# EAGLE schematic untitled (EAGLE 9.6.2)
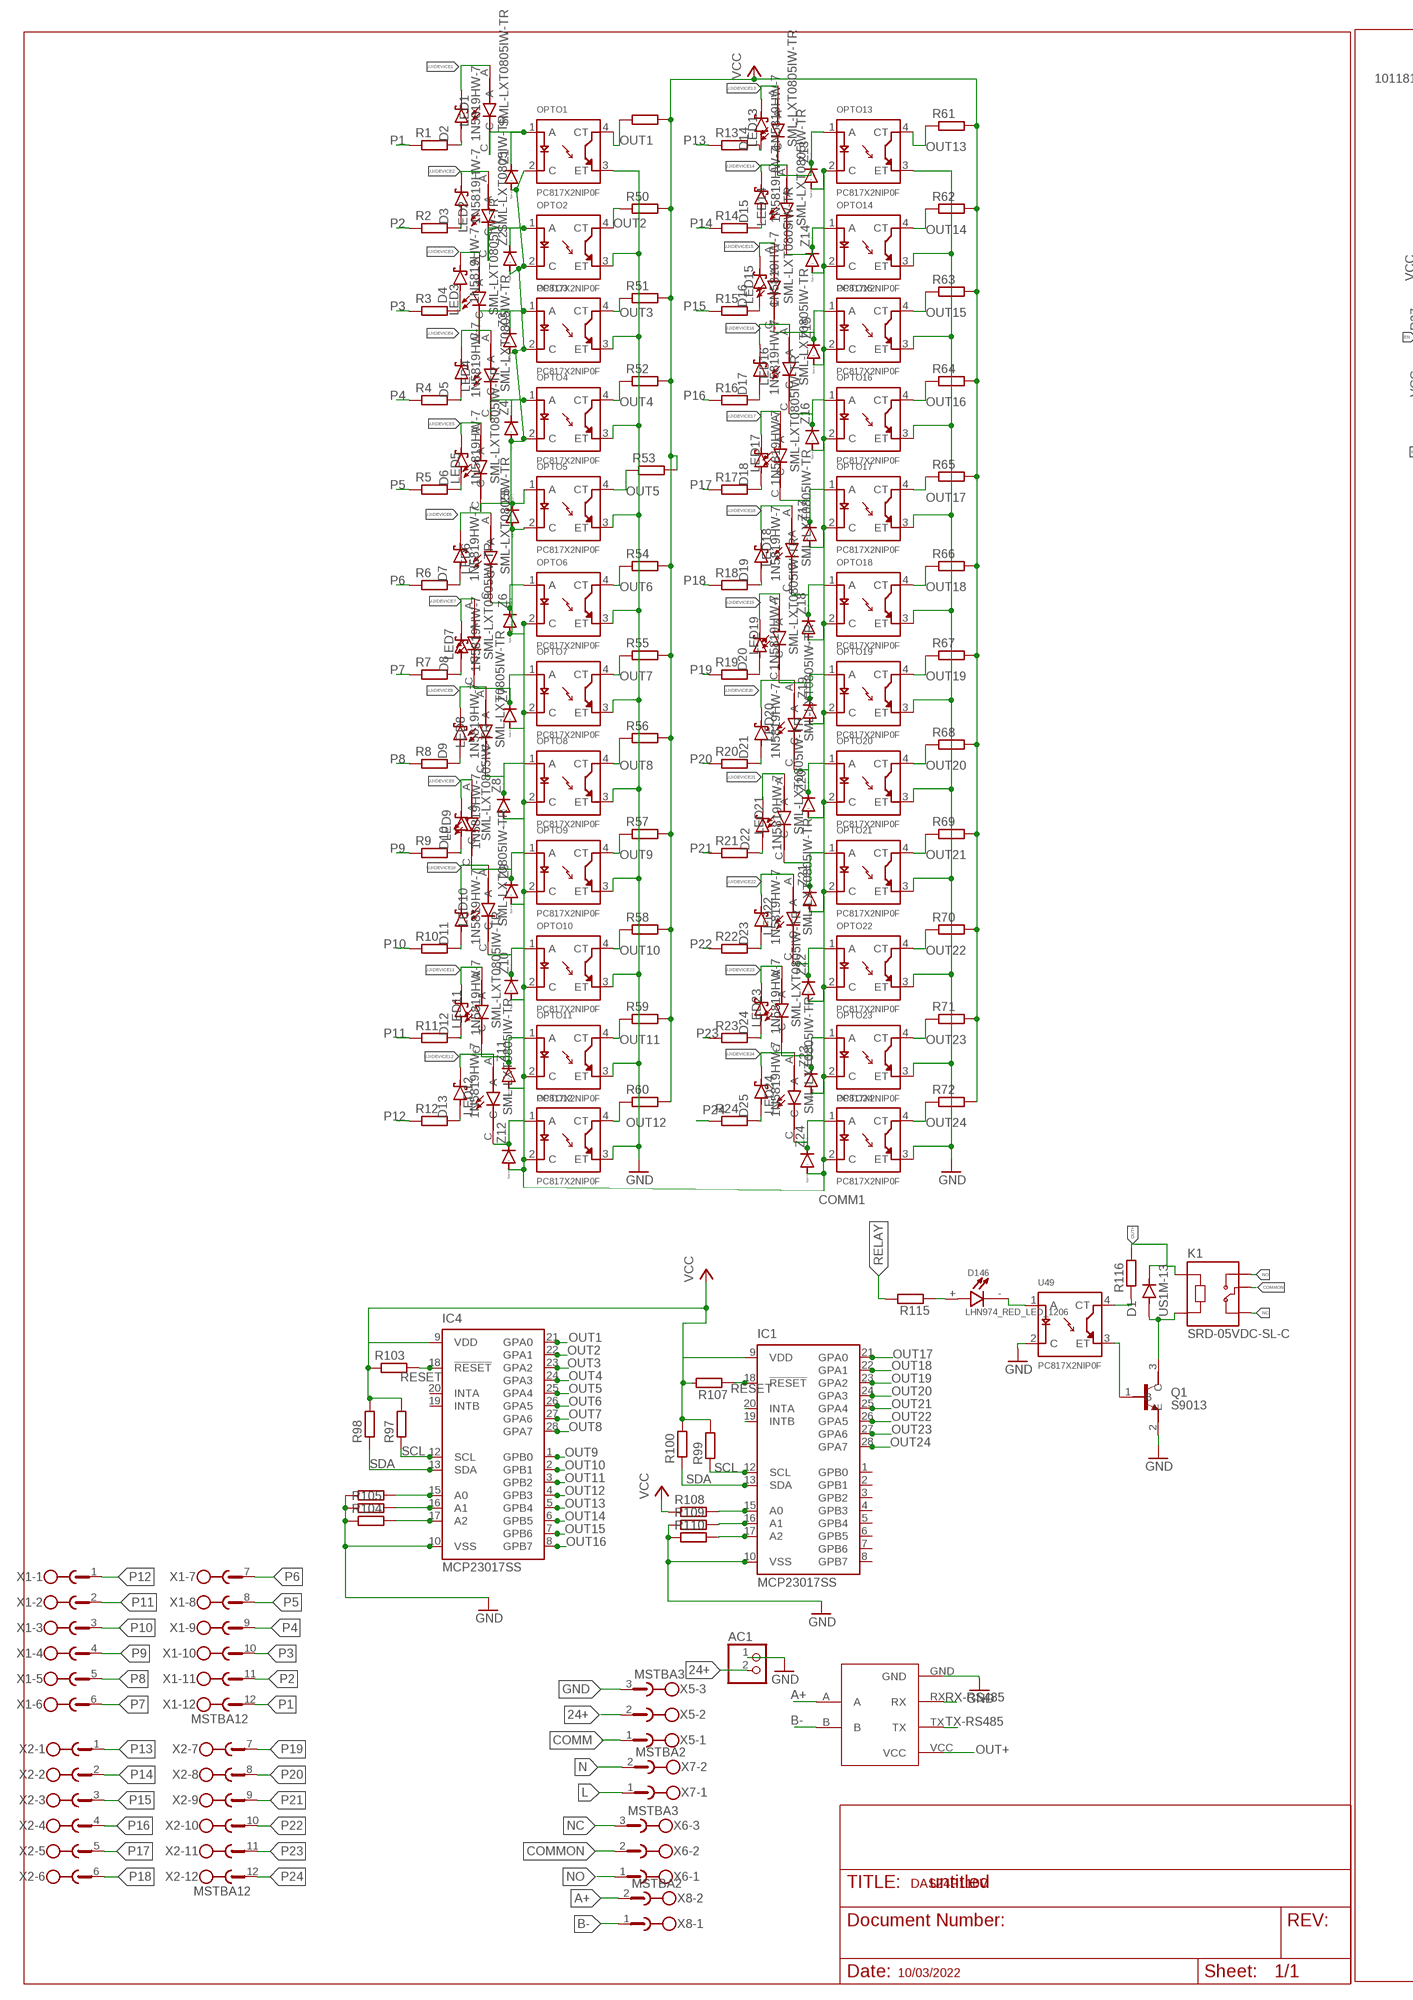
[diagram p0: schematic, sheet 1, part 1 of 2]
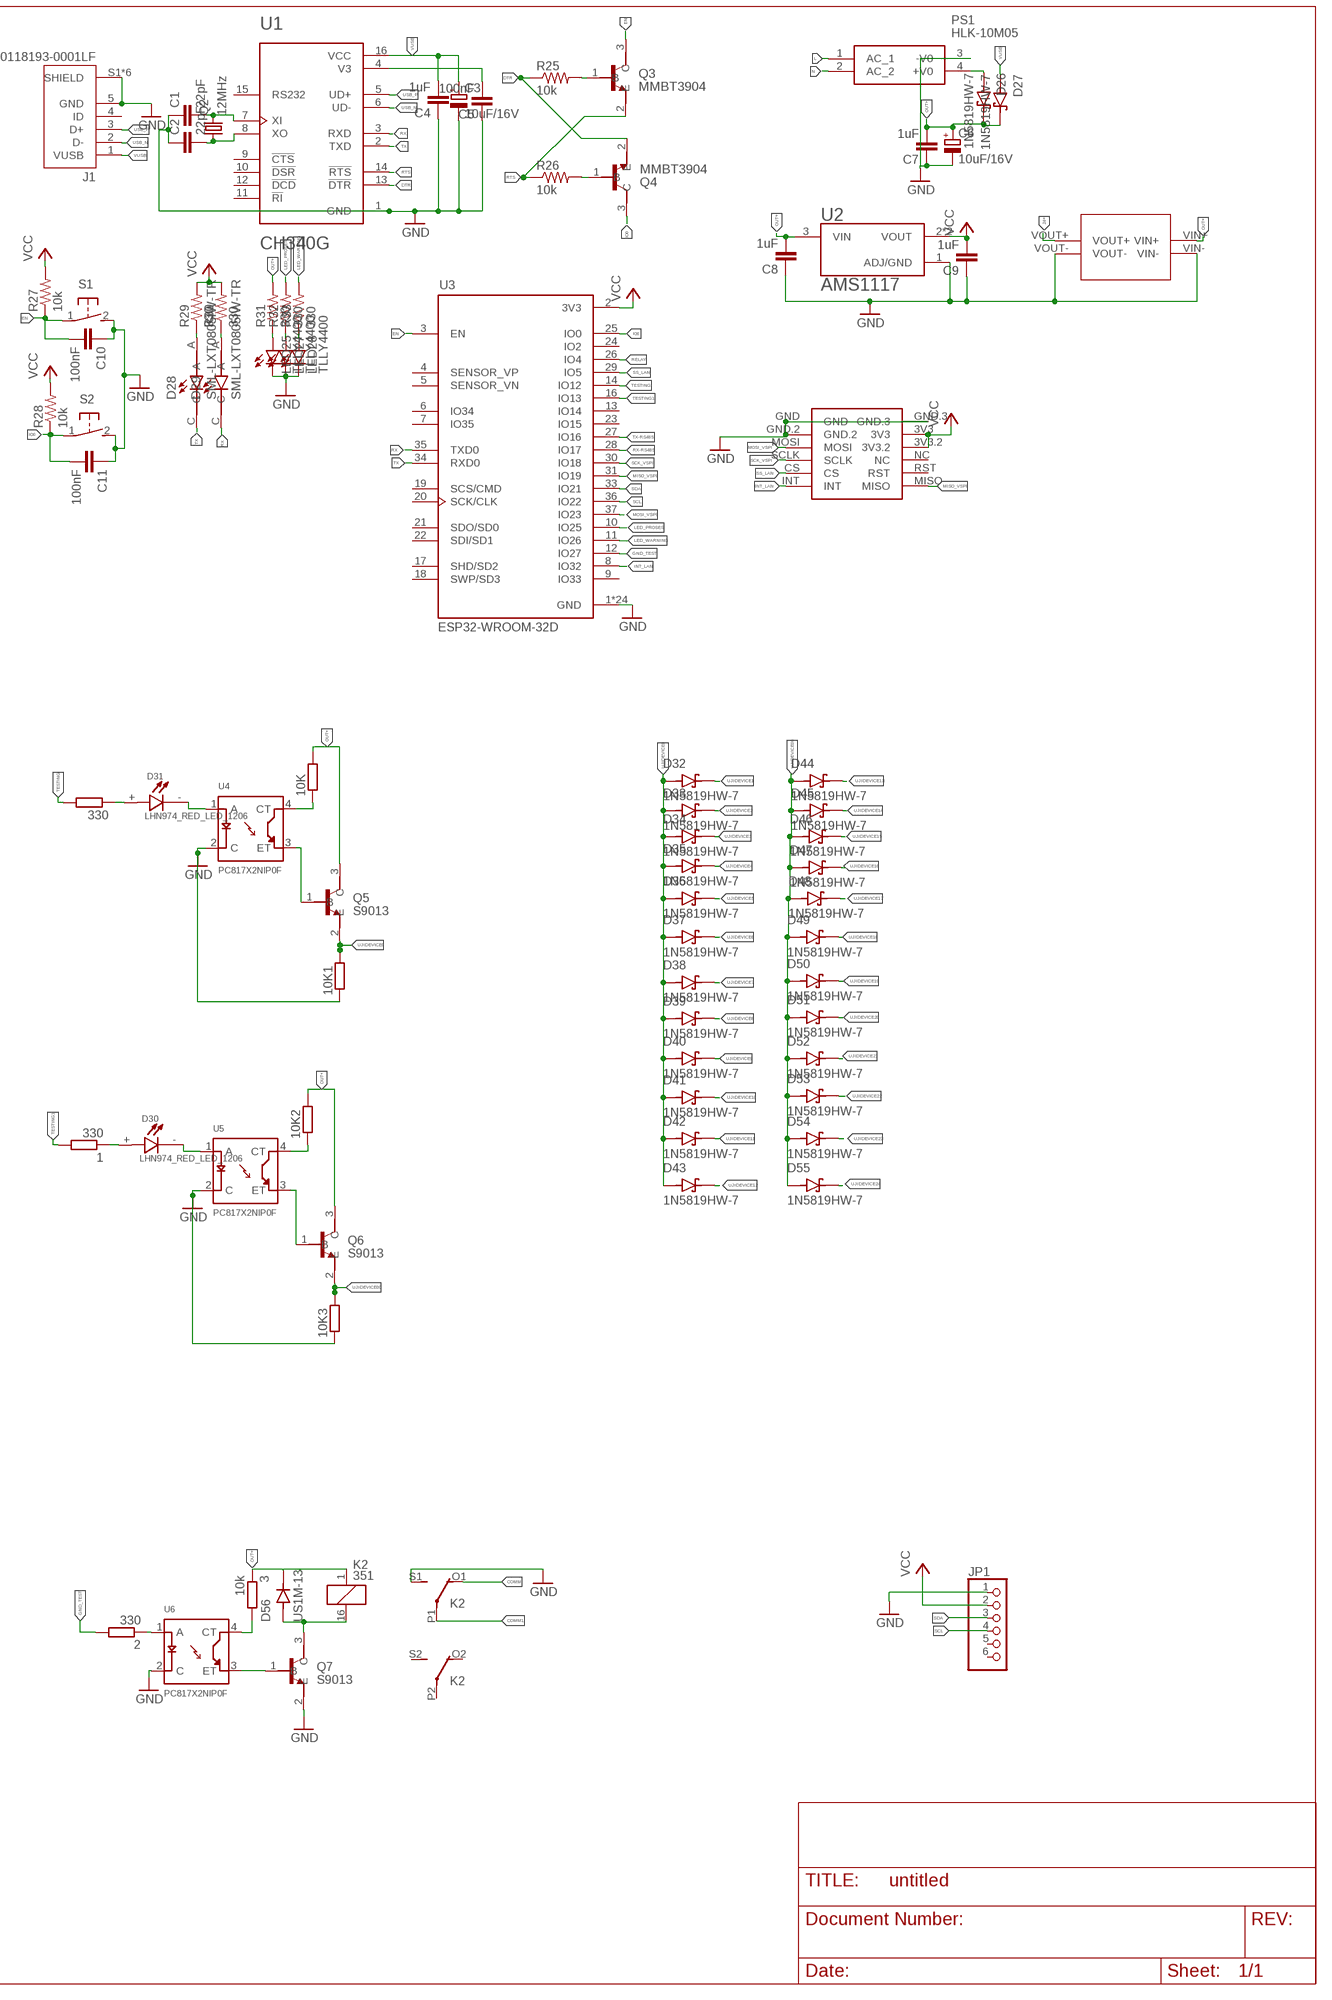
[diagram p1: schematic, sheet 1, part 2 of 2]

## Parts
1  330  R-EU_R0805  [R0805]
2  330  R-EU_R0805  [R0805]
3  10k  R-EU_R0805  [R0805]
10K  R-EU_R0805  [R0805]
10K1  R-EU_R0805  [R0805]
10K2  R-EU_R0805  [R0805]
10K3  R-EU_R0805  [R0805]
330  R-EU_R0805  [R0805]
AC1  PINHD-1X2  [1X02]
C1  22pF  C-EUC0805K  [C0805K]
C2  22pF  C-EUC0805K  [C0805K]
C3  10uF/16V  CPOL-EU153CLV-0505  [153CLV-0505]
C4  1uF  C-EUC0805K  [C0805K]
C5  100nF  C-EUC0805K  [C0805K]
C6  10uF/16V  CPOL-EU153CLV-0505  [153CLV-0505]
C7  1uF  C-EUC0805K  [C0805K]
C8  1uF  C-EUC0805K  [C0805K]
C9  1uF  C-EUC0805K  [C0805K]
C10  100nF  C-EUC0805K  [C0805K]
C11  100nF  C-EUC0805K  [C0805K]
D1  US1M-13  [DIOM5226X240N]
D2  1N5819HW-7  [SOD3715X145N]
D3  1N5819HW-7  [SOD3715X145N]
D4  1N5819HW-7  [SOD3715X145N]
D5  1N5819HW-7  [SOD3715X145N]
D6  1N5819HW-7  [SOD3715X145N]
D7  1N5819HW-7  [SOD3715X145N]
D8  1N5819HW-7  [SOD3715X145N]
D9  1N5819HW-7  [SOD3715X145N]
D10  1N5819HW-7  [SOD3715X145N]
D11  1N5819HW-7  [SOD3715X145N]
D12  1N5819HW-7  [SOD3715X145N]
D13  1N5819HW-7  [SOD3715X145N]
D14  1N5819HW-7  [SOD3715X145N]
D15  1N5819HW-7  [SOD3715X145N]
D16  1N5819HW-7  [SOD3715X145N]
D17  1N5819HW-7  [SOD3715X145N]
D18  1N5819HW-7  [SOD3715X145N]
D19  1N5819HW-7  [SOD3715X145N]
D20  1N5819HW-7  [SOD3715X145N]
D21  1N5819HW-7  [SOD3715X145N]
D22  1N5819HW-7  [SOD3715X145N]
D23  1N5819HW-7  [SOD3715X145N]
D24  1N5819HW-7  [SOD3715X145N]
D25  1N5819HW-7  [SOD3715X145N]
D26  1N5819HW-7  [SOD3715X145N]
D27  1N5819HW-7  [SOD3715X145N]
D28  SML-LXT0805IW-TR  [LEDC2012X120N]
D29  SML-LXT0805IW-TR  [LEDC2012X120N]
D30  LHN974_RED_LED_1206  [LEDC3216X120N]
D31  LHN974_RED_LED_1206  [LEDC3216X120N]
D32  1N5819HW-7  [SOD3715X145N]
D33  1N5819HW-7  [SOD3715X145N]
D34  1N5819HW-7  [SOD3715X145N]
D35  1N5819HW-7  [SOD3715X145N]
D36  1N5819HW-7  [SOD3715X145N]
D37  1N5819HW-7  [SOD3715X145N]
D38  1N5819HW-7  [SOD3715X145N]
D39  1N5819HW-7  [SOD3715X145N]
D40  1N5819HW-7  [SOD3715X145N]
D41  1N5819HW-7  [SOD3715X145N]
D42  1N5819HW-7  [SOD3715X145N]
D43  1N5819HW-7  [SOD3715X145N]
D44  1N5819HW-7  [SOD3715X145N]
D45  1N5819HW-7  [SOD3715X145N]
D46  1N5819HW-7  [SOD3715X145N]
D47  1N5819HW-7  [SOD3715X145N]
D48  1N5819HW-7  [SOD3715X145N]
D49  1N5819HW-7  [SOD3715X145N]
D50  1N5819HW-7  [SOD3715X145N]
D51  1N5819HW-7  [SOD3715X145N]
D52  1N5819HW-7  [SOD3715X145N]
D53  1N5819HW-7  [SOD3715X145N]
D54  1N5819HW-7  [SOD3715X145N]
D55  1N5819HW-7  [SOD3715X145N]
D56  US1M-13  [DIOM5226X240N]
D146  LHN974_RED_LED_1206  [LEDC3216X120N]
IC1  MCP23017SS  [SSOP28DB]
IC4  MCP23017SS  [SSOP28DB]
J1  10118193-0001LF  [FCI_10118193-0001LF]
JP1  PINHD-1X6CLEAN  [1X06-CLEAN]
K1  SRD-05VDC-SL-C  [RELAY_SRD-05VDC-SL-C]
K2  351  [351]
LED1  SML-LXT0805IW-TR  [LEDC2012X120N]
LED2  SML-LXT0805IW-TR  [LEDC2012X120N]
LED3  SML-LXT0805IW-TR  [LEDC2012X120N]
LED4  SML-LXT0805IW-TR  [LEDC2012X120N]
LED5  SML-LXT0805IW-TR  [LEDC2012X120N]
LED6  SML-LXT0805IW-TR  [LEDC2012X120N]
LED7  SML-LXT0805IW-TR  [LEDC2012X120N]
LED8  SML-LXT0805IW-TR  [LEDC2012X120N]
LED9  SML-LXT0805IW-TR  [LEDC2012X120N]
LED10  SML-LXT0805IW-TR  [LEDC2012X120N]
LED11  SML-LXT0805IW-TR  [LEDC2012X120N]
LED12  SML-LXT0805IW-TR  [LEDC2012X120N]
LED13  SML-LXT0805IW-TR  [LEDC2012X120N]
LED14  SML-LXT0805IW-TR  [LEDC2012X120N]
LED15  SML-LXT0805IW-TR  [LEDC2012X120N]
LED16  SML-LXT0805IW-TR  [LEDC2012X120N]
LED17  SML-LXT0805IW-TR  [LEDC2012X120N]
LED18  SML-LXT0805IW-TR  [LEDC2012X120N]
LED19  SML-LXT0805IW-TR  [LEDC2012X120N]
LED20  SML-LXT0805IW-TR  [LEDC2012X120N]
LED21  SML-LXT0805IW-TR  [LEDC2012X120N]
LED22  SML-LXT0805IW-TR  [LEDC2012X120N]
LED23  SML-LXT0805IW-TR  [LEDC2012X120N]
LED24  SML-LXT0805IW-TR  [LEDC2012X120N]
LED25  TLLY4400  [LED3MM]
LED27  TLLY4400  [LED3MM]
LED28  TLLY4400  [LED3MM]
MT1  MT3608  [MT3608]
OPTO1  PC817X2NIP0F  [SOT254P975X400-4N]
OPTO2  PC817X2NIP0F  [SOT254P975X400-4N]
OPTO3  PC817X2NIP0F  [SOT254P975X400-4N]
OPTO4  PC817X2NIP0F  [SOT254P975X400-4N]
OPTO5  PC817X2NIP0F  [SOT254P975X400-4N]
OPTO6  PC817X2NIP0F  [SOT254P975X400-4N]
OPTO7  PC817X2NIP0F  [SOT254P975X400-4N]
OPTO8  PC817X2NIP0F  [SOT254P975X400-4N]
OPTO9  PC817X2NIP0F  [SOT254P975X400-4N]
OPTO10  PC817X2NIP0F  [SOT254P975X400-4N]
OPTO11  PC817X2NIP0F  [SOT254P975X400-4N]
OPTO12  PC817X2NIP0F  [SOT254P975X400-4N]
OPTO13  PC817X2NIP0F  [SOT254P975X400-4N]
OPTO14  PC817X2NIP0F  [SOT254P975X400-4N]
OPTO15  PC817X2NIP0F  [SOT254P975X400-4N]
OPTO16  PC817X2NIP0F  [SOT254P975X400-4N]
OPTO17  PC817X2NIP0F  [SOT254P975X400-4N]
OPTO18  PC817X2NIP0F  [SOT254P975X400-4N]
OPTO19  PC817X2NIP0F  [SOT254P975X400-4N]
OPTO20  PC817X2NIP0F  [SOT254P975X400-4N]
OPTO21  PC817X2NIP0F  [SOT254P975X400-4N]
OPTO22  PC817X2NIP0F  [SOT254P975X400-4N]
OPTO23  PC817X2NIP0F  [SOT254P975X400-4N]
OPTO24  PC817X2NIP0F  [SOT254P975X400-4N]
PS1  HLK-10M05  [HLK10M05]
Q1  S9013  [SOT95P240X120-3N]
Q2  12MHz  CRYSTALSM49  [SM49]
Q3  MMBT3904  [SOT95P240X120-3N]
Q4  MMBT3904  [SOT95P240X120-3N]
Q5  S9013  [SOT95P240X120-3N]
Q6  S9013  [SOT95P240X120-3N]
Q7  S9013  [SOT95P240X120-3N]
R1  R-EU_0414/15  [0414/15]
R2  R-EU_0414/15  [0414/15]
R3  R-EU_0414/15  [0414/15]
R4  R-EU_0414/15  [0414/15]
R5  R-EU_0414/15  [0414/15]
R6  R-EU_0414/15  [0414/15]
R7  R-EU_0414/15  [0414/15]
R8  R-EU_0414/15  [0414/15]
R9  R-EU_0414/15  [0414/15]
R10  R-EU_0414/15  [0414/15]
R11  R-EU_0414/15  [0414/15]
R12  R-EU_0414/15  [0414/15]
R13  R-EU_0414/15  [0414/15]
R14  R-EU_0414/15  [0414/15]
R15  R-EU_0414/15  [0414/15]
R16  R-EU_0414/15  [0414/15]
R17  R-EU_0414/15  [0414/15]
R18  R-EU_0414/15  [0414/15]
R19  R-EU_0414/15  [0414/15]
R20  R-EU_0414/15  [0414/15]
R21  R-EU_0414/15  [0414/15]
R22  R-EU_0414/15  [0414/15]
R23  R-EU_0414/15  [0414/15]
R24  R-EU_0414/15  [0414/15]
R25  10k  R-US_M0805  [M0805]
R26  10k  R-US_M0805  [M0805]
R27  10k  R-US_M0805  [M0805]
R28  10k  R-US_M0805  [M0805]
R29  330  R-US_M0805  [M0805]
R30  330  R-US_M0805  [M0805]
R31  330  R-US_M0805  [M0805]
R32  330  R-US_M0805  [M0805]
R33  330  R-US_M0805  [M0805]
R49  R-EU_R0805  [R0805]
R50  R-EU_R0805  [R0805]
R51  R-EU_R0805  [R0805]
R52  R-EU_R0805  [R0805]
R53  R-EU_R0805  [R0805]
R54  R-EU_R0805  [R0805]
R55  R-EU_R0805  [R0805]
R56  R-EU_R0805  [R0805]
R57  R-EU_R0805  [R0805]
R58  R-EU_R0805  [R0805]
R59  R-EU_R0805  [R0805]
R60  R-EU_R0805  [R0805]
R61  R-EU_R0805  [R0805]
R62  R-EU_R0805  [R0805]
R63  R-EU_R0805  [R0805]
R64  R-EU_R0805  [R0805]
R65  R-EU_R0805  [R0805]
R66  R-EU_R0805  [R0805]
R67  R-EU_R0805  [R0805]
R68  R-EU_R0805  [R0805]
R69  R-EU_R0805  [R0805]
R70  R-EU_R0805  [R0805]
R71  R-EU_R0805  [R0805]
R72  R-EU_R0805  [R0805]
R97  R-EU_R0805  [R0805]
R98  R-EU_R0805  [R0805]
R99  R-EU_R0805  [R0805]
R100  R-EU_R0805  [R0805]
R103  R-EU_R0805  [R0805]
R104  R-EU_R0805  [R0805]
R105  R-EU_R0805  [R0805]
R106  R-EU_R0805  [R0805]
R107  R-EU_R0805  [R0805]
R108  R-EU_R0805  [R0805]
R109  R-EU_R0805  [R0805]
R110  R-EU_R0805  [R0805]
R115  R-EU_R0805  [R0805]
R116  R-EU_R0805  [R0805]
S1  31-XX  [B3F-31XX]
S2  31-XX  [B3F-31XX]
TTL-RS1  TTL-RS485  [TTL-RS485]
U1  CH340G  [SOIC127P600X180-16N]
U2  AMS1117  [SOT229P700X180-4N]
U3  ESP32-WROOM-32D  [MODULE_ESP32-WROOM-32D]
U4  PC817X2NIP0F  [SOT254P975X400-4N]
U5  PC817X2NIP0F  [SOT254P975X400-4N]
U6  PC817X2NIP0F  [SOT254P975X400-4N]
U49  PC817X2NIP0F  [SOT254P975X400-4N]
U$1  MINI_W5500  [MINI_W5500]
X1  MSTBA12  [MSTBA12]
X2  MSTBA12  [MSTBA12]
X5  MSTBA3  [MSTBA3]
X6  MSTBA3  [MSTBA3]
X7  MSTBA2  [MSTBA2]
X8  MSTBA2  [MSTBA2]
Z1  DIODE-SOD123  [SOD123]
Z2  DIODE-SOD123  [SOD123]
Z3  DIODE-SOD123  [SOD123]
Z4  DIODE-SOD123  [SOD123]
Z5  DIODE-SOD123  [SOD123]
Z6  DIODE-SOD123  [SOD123]
Z7  DIODE-SOD123  [SOD123]
Z8  DIODE-SOD123  [SOD123]
Z9  DIODE-SOD123  [SOD123]
Z10  DIODE-SOD123  [SOD123]
Z11  DIODE-SOD123  [SOD123]
Z12  DIODE-SOD123  [SOD123]
Z13  DIODE-SOD123  [SOD123]
Z14  DIODE-SOD123  [SOD123]
Z15  DIODE-SOD123  [SOD123]
Z16  DIODE-SOD123  [SOD123]
Z17  DIODE-SOD123  [SOD123]
Z18  DIODE-SOD123  [SOD123]
Z19  DIODE-SOD123  [SOD123]
Z20  DIODE-SOD123  [SOD123]
Z21  DIODE-SOD123  [SOD123]
Z22  DIODE-SOD123  [SOD123]
Z23  DIODE-SOD123  [SOD123]
Z24  DIODE-SOD123  [SOD123]

## Nets
24+: AC1.2 MT1.VOUT+ X5.2
A+: TTL-RS1.A X8.2
B-: TTL-RS1.B X8.1
COMM: K2.O1(2:O) X5.1
COMM1: K2.P1(2:P) OPTO1.2(C) OPTO2.2(C) OPTO3.2(C) OPTO4.2(C) OPTO5.2(C) OPTO6.2(C) OPTO7.2(C) OPTO8.2(C) OPTO9.2(C) OPTO10.2(C) OPTO11.2(C) OPTO12.2(C) OPTO13.2(C) OPTO14.2(C) OPTO15.2(C) OPTO16.2(C) OPTO17.2(C) OPTO18.2(C) OPTO19.2(C) OPTO20.2(C) OPTO21.2(C) OPTO22.2(C) OPTO23.2(C) OPTO24.2(C) Z1.A Z2.A Z3.A Z4.A Z5.A Z6.A Z7.A Z8.A Z9.A Z10.A Z11.A Z12.A Z13.A Z14.A Z15.A Z16.A Z17.A Z18.A Z19.A Z20.A Z21.A Z22.A Z23.A Z24.A
COMMON: K1.COM X6.2
DTR: Q4.2(E) R25.1 U1.13(!DTR)
EN: C10.2 Q3.3(C) R27.1 S1.1(P) U3.3(EN)
GND: 10K1.1 10K3.1 AC1.1 C1.1 C2.1 C3.- C4.1 C5.1 C6.- C7.1 C8.1 C9.1 C10.1 C11.1 IC1.10(VSS) IC4.10(VSS) J1.5(GND) J1.S1(SHIELD) J1.S2(SHIELD) J1.S3(SHIELD) J1.S4(SHIELD) J1.S5(SHIELD) J1.S6(SHIELD) JP1.1 K2.S1(2:S) LED25.K(C) LED27.K(C) LED28.K(C) MT1.VIN- MT1.VOUT- OPTO1.3(ET) OPTO2.3(ET) OPTO3.3(ET) OPTO4.3(ET) OPTO5.3(ET) OPTO6.3(ET) OPTO7.3(ET) OPTO8.3(ET) OPTO9.3(ET) OPTO10.3(ET) OPTO11.3(ET) OPTO12.3(ET) OPTO13.3(ET) OPTO14.3(ET) OPTO15.3(ET) OPTO16.3(ET) OPTO17.3(ET) OPTO18.3(ET) OPTO19.3(ET) OPTO20.3(ET) OPTO21.3(ET) OPTO22.3(ET) OPTO23.3(ET) OPTO24.3(ET) PS1.3(-V0) Q1.2(E) Q7.2(E) R104.1 R105.1 R106.1 R109.1 R110.1 S1.2(S) S2.2(S) TTL-RS1.GND U1.1(GND) U2.1(ADJ/GND) U3.1(GND) U3.15(GND) U3.38(GND) U3.39_1(GND) U3.39_2(GND) U3.39_3(GND) U3.39_4(GND) U3.39_5(GND) U3.39_6(GND) U3.39_7(GND) U3.39_8(GND) U3.39_9(GND) U3.39_10(GND) U3.39_11(GND) U3.39_12(GND) U3.39_13(GND) U3.39_14(GND) U3.39_15(GND) U3.39_16(GND) U3.39_17(GND) U3.39_18(GND) U3.39_19(GND) U3.39_20(GND) U3.39_21(GND) U4.2(C) U5.2(C) U6.2(C) U49.2(C) U$1.GND U$1.GND.2 U$1.GND.3 X5.3
GND_TEST: 2.2 U3.12(IO27)
INT_LAN: U3.8(IO32) U$1.INT
IO0: C11.2 Q4.3(C) R28.1 S2.1(P) U3.25(IO0)
L: PS1.1(AC_1) X7.1
LED_PROSES: R32.2 U3.10(IO25)
LED_WARNING: R33.2 U3.11(IO26)
MISO_VSPI: U3.31(IO19) U$1.MISO
MOSI_VSPI: U3.37(IO23) U$1.MOSI
N: PS1.2(AC_2) X7.2
N$1: D2.A R1.2
N$2: LED10.C OPTO10.1(A) Z10.C
N$3: D3.A R2.2
N$5: D4.A R3.2
N$6: LED1.C OPTO1.1(A) Z1.C
N$7: D5.A R4.2
N$8: LED27.A R32.1
N$9: D6.A R5.2
N$10: LED28.A R33.1
N$11: D7.A R6.2
N$12: LED2.C OPTO2.1(A) Z2.C
N$13: D8.A R7.2
N$14: 2.1 U6.1(A)
N$15: D9.A R8.2
N$16: LED3.C OPTO3.1(A) Z3.C
N$17: D15.A R14.2
N$18: 3.2 U6.4(CT)
N$19: LED4.C OPTO4.1(A) Z4.C
N$20: D10.A R9.2
N$22: LED5.C OPTO5.1(A) Z5.C
N$23: D56.A K2.16 Q7.3(C)
N$24: D11.A R10.2
N$25: Q7.1(B) U6.3(ET)
N$26: LED6.C OPTO6.1(A) Z6.C
N$27: C1.2 Q2.2 U1.7(XI)
N$28: D12.A R11.2
N$29: C2.2 Q2.1 U1.8(XO)
N$30: Q3.1(B) R25.2
N$32: C5.2 U1.4(V3)
N$33: Q4.1(B) R26.2
N$34: D26.A PS1.4(+V0)
N$35: 330.1 D31.+
N$36: D13.A R12.2
N$37: LED25.A R31.1
N$38: D28.A R29.1
N$39: D29.A R30.1
N$40: D14.A R13.2
N$41: 1.1 D30.+
N$42: D31.- U4.1(A)
N$43: 10K.1 U4.4(CT)
N$44: D16.A R15.2
N$45: Q5.1(B) U4.3(ET)
N$46: D30.- U5.1(A)
N$47: 10K2.1 U5.4(CT)
N$48: D17.A R16.2
N$52: D18.A R17.2
N$56: D19.A R18.2
N$60: D20.A R19.2
N$66: D21.A R20.2
N$70: LED7.C OPTO7.1(A) Z7.C
N$71: D22.A R21.2
N$72: LED8.C OPTO8.1(A) Z8.C
N$73: LED9.C OPTO9.1(A) Z9.C
N$74: LED11.C OPTO11.1(A) Z11.C
N$75: LED12.C OPTO12.1(A) Z12.C
N$76: D23.A R22.2
N$77: LED13.C OPTO13.1(A) Z13.C
N$78: LED14.C OPTO14.1(A) Z14.C
N$79: LED15.C OPTO15.1(A) Z15.C
N$80: D24.A R23.2
N$81: LED16.C OPTO16.1(A) Z16.C
N$82: LED17.C OPTO17.1(A) Z17.C
N$83: LED18.C OPTO18.1(A) Z18.C
N$84: D25.A R24.2
N$85: LED19.C OPTO19.1(A) Z19.C
N$86: LED20.C OPTO20.1(A) Z20.C
N$87: LED21.C OPTO21.1(A) Z21.C
N$88: LED22.C OPTO22.1(A) Z22.C
N$89: LED23.C OPTO23.1(A) Z23.C
N$90: LED24.C OPTO24.1(A) Z24.C
N$91: Q6.1(B) U5.3(ET)
N$97: D146.- U49.1(A)
N$98: D146.+ R115.1
N$99: R116.1 U49.4(CT)
N$101: D1.A K1.A2 Q1.3(C)
N$102: Q1.1(B) U49.3(ET)
N$107: IC1.15(A0) R108.2
N$108: IC1.16(A1) R109.2
N$109: IC4.15(A0) R106.2
N$110: IC4.16(A1) R105.2
N$111: IC4.17(A2) R104.2
N$113: IC1.17(A2) R110.2
N$135: IC1.20(INTA)
N$136: IC1.19(INTB)
NC: K1.NC X6.3
NO: K1.NO X6.1
OUT1: IC4.21(GPA0) OPTO1.4(CT) R49.1
OUT2: IC4.22(GPA1) OPTO2.4(CT) R50.1
OUT3: IC4.23(GPA2) OPTO3.4(CT) R51.1
OUT4: IC4.24(GPA3) OPTO4.4(CT) R52.1
OUT5: IC4.25(GPA4) OPTO5.4(CT) R53.1
OUT6: IC4.26(GPA5) OPTO6.4(CT) R54.1
OUT7: IC4.27(GPA6) OPTO7.4(CT) R55.1
OUT8: IC4.28(GPA7) OPTO8.4(CT) R56.1
OUT9: IC4.1(GPB0) OPTO9.4(CT) R57.1
OUT10: IC4.2(GPB1) OPTO10.4(CT) R58.1
OUT11: IC4.3(GPB2) OPTO11.4(CT) R59.1
OUT12: IC4.4(GPB3) OPTO12.4(CT) R60.1
OUT13: IC4.5(GPB4) OPTO13.4(CT) R61.1
OUT14: IC4.6(GPB5) OPTO14.4(CT) R62.1
OUT15: IC4.7(GPB6) OPTO15.4(CT) R63.1
OUT16: IC4.8(GPB7) OPTO16.4(CT) R64.1
OUT17: IC1.21(GPA0) OPTO17.4(CT) R65.1
OUT18: IC1.22(GPA1) OPTO18.4(CT) R66.1
OUT19: IC1.23(GPA2) OPTO19.4(CT) R67.1
OUT20: IC1.24(GPA3) OPTO20.4(CT) R68.1
OUT21: IC1.25(GPA4) OPTO21.4(CT) R69.1
OUT22: IC1.26(GPA5) OPTO22.4(CT) R70.1
OUT23: IC1.27(GPA6) OPTO23.4(CT) R71.1
OUT24: IC1.28(GPA7) OPTO24.4(CT) R72.1
OUT+: 3.1 10K2.2 10K.2 C6.+ C7.2 C8.2 D1.C(K) D26.C(K) D27.C(K) D56.C(K) K1.A1 K2.1 MT1.VIN+ Q5.3(C) Q6.3(C) R31.2 R116.2 TTL-RS1.VCC U2.3(VIN)
P1: R1.1 X1.12
P2: R2.1 X1.11
P3: R3.1 X1.10
P4: R4.1 X1.9
P5: R5.1 X1.8
P6: R6.1 X1.7
P7: R7.1 X1.6
P8: R8.1 X1.5
P9: R9.1 X1.4
P10: R10.1 X1.3
P11: R11.1 X1.2
P12: R12.1 X1.1
P13: R13.1 X2.1
P14: R14.1 X2.2
P15: R15.1 X2.3
P16: R16.1 X2.4
P17: R17.1 X2.5
P18: R18.1 X2.6
P19: R19.1 X2.7
P20: R20.1 X2.8
P21: R21.1 X2.9
P22: R22.1 X2.10
P23: R23.1 X2.11
P24: R24.1 X2.12
RELAY: R115.2 U3.26(IO4)
RESET: IC1.18(!RESET) IC4.18(!RESET) R103.2 R107.1
RTS: Q3.2(E) R26.1 U1.14(!RTS)
RX: D29.C U1.3(RXD) U3.35(TXD0)
RX-RS485: TTL-RS1.RX U3.28(IO17)
SCK_VSPI: U3.30(IO18) U$1.SCLK
SCL: IC1.12(SCL) IC4.12(SCL) JP1.4 R97.1 R99.1 U3.36(IO22)
SDA: IC1.13(SDA) IC4.13(SDA) JP1.3 R98.1 R100.1 U3.33(IO21)
SS_LAN: U3.29(IO5) U$1.CS
TESTING: 330.2 U3.14(IO12)
TESTING1: 1.2 U3.16(IO13)
TX: D28.C U1.2(TXD) U3.34(RXD0)
TX-RS485: TTL-RS1.TX U3.27(IO16)
UJIDEVICE0: 10K1.2 D32.A D33.A D34.A D35.A D36.A D37.A D38.A D39.A D40.A D41.A D42.A D43.A Q5.2(E)
UJIDEVICE00: 10K3.2 D44.A D45.A D46.A D47.A D48.A D49.A D50.A D51.A D52.A D53.A D54.A D55.A Q6.2(E)
UJIDEVICE1: D2.C(K) D32.C(K) LED1.A
UJIDEVICE2: D3.C(K) D33.C(K) LED2.A
UJIDEVICE3: D4.C(K) D34.C(K) LED3.A
UJIDEVICE4: D5.C(K) D35.C(K) LED4.A
UJIDEVICE5: D6.C(K) D36.C(K) LED5.A
UJIDEVICE6: D7.C(K) D37.C(K) LED6.A
UJIDEVICE7: D8.C(K) D38.C(K) LED7.A
UJIDEVICE8: D9.C(K) D39.C(K) LED8.A
UJIDEVICE9: D10.C(K) D40.C(K) LED9.A
UJIDEVICE10: D11.C(K) D41.C(K) LED10.A
UJIDEVICE11: D12.C(K) D42.C(K) LED11.A
UJIDEVICE12: D13.C(K) D43.C(K) LED12.A
UJIDEVICE13: D14.C(K) D44.C(K) LED13.A
UJIDEVICE14: D15.C(K) D45.C(K) LED14.A
UJIDEVICE15: D16.C(K) D46.C(K) LED15.A
UJIDEVICE16: D17.C(K) D47.C(K) LED16.A
UJIDEVICE17: D18.C(K) D48.C(K) LED17.A
UJIDEVICE18: D19.C(K) D49.C(K) LED18.A
UJIDEVICE19: D20.C(K) D50.C(K) LED19.A
UJIDEVICE20: D21.C(K) D51.C(K) LED20.A
UJIDEVICE21: D22.C(K) D52.C(K) LED21.A
UJIDEVICE22: D23.C(K) D53.C(K) LED22.A
UJIDEVICE23: D24.C(K) D54.C(K) LED23.A
UJIDEVICE24: D25.C(K) D55.C(K) LED24.A
USB_N: J1.2(D-) U1.6(UD-)
USB_P: J1.3(D+) U1.5(UD+)
VCC: C9.2 IC1.9(VDD) IC4.9(VDD) JP1.2 R27.2 R28.2 R29.2 R30.2 R49.2 R50.2 R51.2 R52.2 R53.2 R54.2 R55.2 R56.2 R57.2 R58.2 R59.2 R60.2 R61.2 R62.2 R63.2 R64.2 R65.2 R66.2 R67.2 R68.2 R69.2 R70.2 R71.2 R72.2 R97.2 R98.2 R99.2 R100.2 R103.1 R107.2 R108.1 U2.2(VOUT) U2.4(VOUT) U3.2(3V3) U$1.3V3 U$1.3V3.2
VUSB: C3.+ C4.2 D27.A J1.1(VUSB) U1.16(VCC)
Unconnected: IC1.1(GPB0) IC1.2(GPB1) IC1.3(GPB2) IC1.4(GPB3) IC1.5(GPB4) IC1.6(GPB5) IC1.7(GPB6) IC1.8(GPB7) IC4.19(INTB) IC4.20(INTA) J1.4(ID) JP1.5 JP1.6 K2.O2(3:O) K2.P2(3:P) K2.S2(3:S) U1.9(!CTS) U1.10(!DSR) U1.11(!RI) U1.12(!DCD) U1.15(RS232) U3.4(SENSOR_VP) U3.5(SENSOR_VN) U3.6(IO34) U3.7(IO35) U3.9(IO33) U3.13(IO14) U3.17(SHD/SD2) U3.18(SWP/SD3) U3.19(SCS/CMD) U3.20(SCK/CLK) U3.21(SDO/SD0) U3.22(SDI/SD1) U3.23(IO15) U3.24(IO2) U$1.NC U$1.RST

## Notes on the sheet
- DAS24P110V
- 10/03/2022

## Library data of the parts
1-3 10K 10K1-10K3 330 R1-R24 R49-R72 R97-R100 R103-R110 R115 R116 = rcl:R-EU_: RESISTOR, European symbol; SPICEPREFIX: R
AC1 = pinhead:PINHD-1X2: PIN HEADER
C1 C2 C4 C5 C7-C11 = rcl:C-EU: CAPACITOR, European symbol; SPICEPREFIX: C
C3 C6 = rcl:CPOL-EU: POLARIZED CAPACITOR, European symbol; SPICEPREFIX: C
D1 D56 = US1M-13:US1M-13: Diode, Fast Recovery, 1a, 1kv, Do-214ac-2, Full Reel Check availability <https://pricing.snapeda.com/parts/US1M-13/Diodes%20Incorporated/view-part?ref=eda>; AVAILABILITY: In Stock; DESCRIPTION: Diode Standard 1000 V 1A Surface Mount SMA; MF: Diodes Incorporated; MP: US1M-13; PACKAGE: DO-214AC-214 Diodes Incorporated; PRICE: None; PURCHASE-URL: https://pricing.snapeda.com/search/part/US1M-13/?ref=eda
D2-D27 D32-D55 = 1N5819HW-7:1N5819HW-7: 1N5819HW Series 40 V 1 A Surface Mount Schottky Barrier Rectifier - SOD-123 Check availability <https://pricing.snapeda.com/parts/1N5819HW-7/Diodes%20Inc./view-part?ref=eda>; AVAILABILITY: In Stock; DESCRIPTION: Diode Schottky 40 V 1A Surface Mount SOD-123; MF: Diodes Inc.; MP: 1N5819HW-7; PACKAGE: SOD-123 Fairchild Semiconductor; PRICE: None; PURCHASE-URL: https://pricing.snapeda.com/search/part/1N5819HW-7/?ref=eda
D28 D29 LED1-LED24 = SML-LXT0805IW-TR:SML-LXT0805IW-TR: LED; Luminous Intensity:11µcd; Viewing Angle:140°; Forward Current:30mA; Forward Voltage:2V; Color:Red; LED Color:Red; Leaded Process Compatible:Yes; Lens Color:White; Mounting Type:Surface Mount ;RoHS Compliant: Yes Check availability <https://pricing.snapeda.com/parts/SML-LXT0805IW-TR/Lumex%20Opto/Components/view-part?ref=eda>; AVAILABILITY: In Stock; DESCRIPTION: Red - LED Indication - Discrete 2V 0805 (2012 Metric); MF: Lumex Opto/Components; MP: SML-LXT0805IW-TR; PACKAGE: 0805 Lumex; PRICE: None; PURCHASE-URL: https://pricing.snapeda.com/search/part/SML-LXT0805IW-TR/?ref=eda
D30 D31 D146 = LHN974_RED_LED_1206:LHN974_RED_LED_1206: LED Chip 1206 Check availability <https://pricing.snapeda.com/parts/LHN974%20RED%20LED%201206/Osram/view-part?ref=eda>; AVAILABILITY: Not in stock; DESCRIPTION: 2.6 V Red LED SMD; MF: Osram; MP: LHN974 RED LED 1206; PACKAGE: None; PRICE: None
IC1 IC4 = adafruit_edited:MCP23017: http://ww1.microchip.com/downloads/en/DeviceDoc/21952a.pdf Source: http://ww1.microchip.com/downloads/en/DeviceDoc/21952a.pdf
J1 = 10118193-0001LF:10118193-0001LF: Micro USB B Type Receptacle Check availability <https://pricing.snapeda.com/parts/10118193-0001LF/FCI/view-part?ref=eda>; AVAILABILITY: In Stock; DESCRIPTION: USB - micro B USB 2.0 Receptacle Connector 5 Position Surface Mount, Right Angle; Through Hole; MF: FCI; MP: 10118193-0001LF; PACKAGE: None; PRICE: None; PURCHASE-URL: https://pricing.snapeda.com/search/part/10118193-0001LF/?ref=eda
JP1 = adafruit:PINHD-1X6: PIN HEADER
K1 = SRD-05VDC-SL-C:SRD-05VDC-SL-C: 5V Trigger Relay Module For Arduino And Raspberry Pi 5V Trigger Relay Module For Arduino And Raspberry Pi Check availability <https://pricing.snapeda.com/parts/SRD-05VDC-SL-C/Songle%20Relay/view-part?ref=eda>; AVAILABILITY: Not in stock; DESCRIPTION: 5V Trigger Relay Module For Arduino And Raspberry Pi 5V Trigger Relay Module For Arduino And Raspberry Pi; MF: Songle Relay; MP: SRD-05VDC-SL-C; PACKAGE: NON STANDARD-5 Songle Relay; PRICE: None
K2 = relay:351: RELAY 2 x switch, Omron; OC_FARNELL: unknown; OC_NEWARK: unknown
LED25 LED27 LED28 = led:TLLY4400: Low Current (2mA) LED 3 mm Tinted Diffused Package color YELLOW Source: Data sheet <http://www.farnell.com/datasheets/391098.pdf>; MF: VISHAY SEMICONDUCTOR; OC_FARNELL: 1612439
MT1 = MT3608:MT3608
OPTO1-OPTO24 U4-U6 U49 = PC817X2NIP0F:PC817X2NIP0F: PC817 Series 1 Channel 80 V 5000 Vrms General Purpose Photocoupler - DIP-4 Check availability <https://pricing.snapeda.com/parts/PC817X2NIP0F/Sharp%20Microelectronics/view-part?ref=eda>; AVAILABILITY: Not in stock; DESCRIPTION: Optoisolator Transistor Output 5000Vrms 1 Channel 4-SMD; MF: Sharp Microelectronics; MP: PC817X2NIP0F; PACKAGE: SMD-4 Sharp Microelectronics; PRICE: None
PS1 = HLK-10M05:HLK-10M05: HI-LINK HLK-10M05 Manufacturer : HI-LINK <https://lcsc.com//brand-detail/11515.html> Mfr.Part # HLK-10M05 LCSC Part # C403745 <https://lcsc.com/product-detail/show_C403745.html> Package : Through Hole Datasheet :  EasyEDA Model <javascript:void(0);> Power Module AC-DC Through Hole RoHS Source: Datasheet <https://datasheet.lcsc.com/szlcsc/1909111105_HI-LINK-HLK-10M05_C403745.pdf> Check availability <https://pricing.snapeda.com/parts/HLK-10M05/Hi-link/view-part?ref=eda>; AVAILABILITY: Not in stock; DESCRIPTION: 10W Ultra-Compact Power Module; MF: Hi-link; MP: HLK-10M05; PACKAGE: Package; PRICE: None
Q1 Q5-Q7 = S9013:S9013: SMD Transistors NPN 25V-500mA Check availability <https://pricing.snapeda.com/parts/S9013/JCET/view-part?ref=eda>; AVAILABILITY: In Stock; DESCRIPTION: Bipolar (BJT) Transistor NPN 20V 500mA 625mW Through Hole TO-92-3; MF: JCET; MP: S9013; PACKAGE: SOT-23-3 JCET; PRICE: None; PURCHASE-URL: https://pricing.snapeda.com/search/part/S9013/?ref=eda
Q2 = crystal:CRYSTAL: CRYSTAL; OC_FARNELL: unknown; OC_NEWARK: unknown
Q3 Q4 = MMBT3904:MMBT3904: MMBT3904 Series 40 V CE Breakdown 0.2 A NPN General Purpose Amplifier - SOT-23 Check availability <https://pricing.snapeda.com/parts/MMBT3904/ON%20Semiconductor/view-part?ref=eda>; AVAILABILITY: In Stock; DESCRIPTION: Bipolar (BJT) Transistor NPN 40 V 200 mA 300MHz 300 mW Surface Mount SOT-23-3 (TO-236); MF: ON Semiconductor; MP: MMBT3904; PACKAGE: SOT-23-3 Motorola; PRICE: None
R25-R33 = rcl:R-US_: RESISTOR, American symbol; SPICEPREFIX: R
S1 S2 = switch-omron:31-XX: OMRON SWITCH; MPN: B3F-3100; OC_FARNELL: 959704; OC_NEWARK: 36M3582
TTL-RS1 = TTL-RS485:TTL-RS485
U1 = CH340G:CH340G: Check availability <https://pricing.snapeda.com/parts/Ch340G/WCH/view-part?ref=eda>; AVAILABILITY: Not in stock; DESCRIPTION: USB Interface Integrated Circuit; MF: WCH; MP: Ch340G; PACKAGE: None; PRICE: None
U2 = AMS1117:AMS1117: Sot223/Pkg 1-Amp 5-Volt Low Drop Out Voltage Regulatator Check availability <https://pricing.snapeda.com/parts/AMS1117/Advanced%20Monolithic%20Systems/view-part?ref=eda>; AVAILABILITY: Not in stock; DESCRIPTION: 1A LOW DROPOUT VOLTAGE REGULATOR SOT-223; MF: Advanced Monolithic Systems; MP: AMS1117; PACKAGE: SOT-223 Seeed Technology; PRICE: None
U3 = ESP32-WROOM-32D:ESP32-WROOM-32D: Bluetooth, WiFi 802.11b/g/n, Bluetooth v4.2 + EDR, Class 1, 2 and 3 Transceiver Module 2.4GHz ~ 2.5GHz Integrated, Trace Surface Mount Check availability <https://pricing.snapeda.com/parts/ESP32-WROOM-32D/Espressif%20Systems/view-part?ref=eda>; AVAILABILITY: In Stock; DESCRIPTION: Bluetooth, WiFi 802.11b/g/n, Bluetooth v4.2 +EDR, Class 1, 2 and 3 Transceiver Module 2.4GHz ~ 2.5GHz Integrated; MF: Espressif Systems; MP: ESP32-WROOM-32D; PACKAGE: Module Espressif Systems; PRICE: None; PURCHASE-URL: https://pricing.snapeda.com/search/part/ESP32-WROOM-32D/?ref=eda
U$1 = ethernet-mikroavr:MINI_W5500: MINI ETHERNET W5500, CREATE BY MIKROAVR.COM
X1 X2 = con-phoenix-508:MSTBA12: PHOENIX; MPN: 1757349; OC_FARNELL: 3705250; OC_NEWARK: 71C4169
X5 X6 = con-phoenix-508:MSTBA3: PHOENIX; MF: FARNELL; MPN: 1757255; OC_FARNELL: 3705183; OC_NEWARK: 71C4162
X7 X8 = con-phoenix-508:MSTBA2: PHOENIX; MF: FARNELL; MPN: 1757242; OC_FARNELL: 3705171; OC_NEWARK: 71C4161
Z1-Z24 = diode:DIODE-: DIODE

## Net classes
0 default: drill 0.3 mm, clearance 0.2 mm